# Altium schematic sheet schematic_v1.SchDoc
size A4
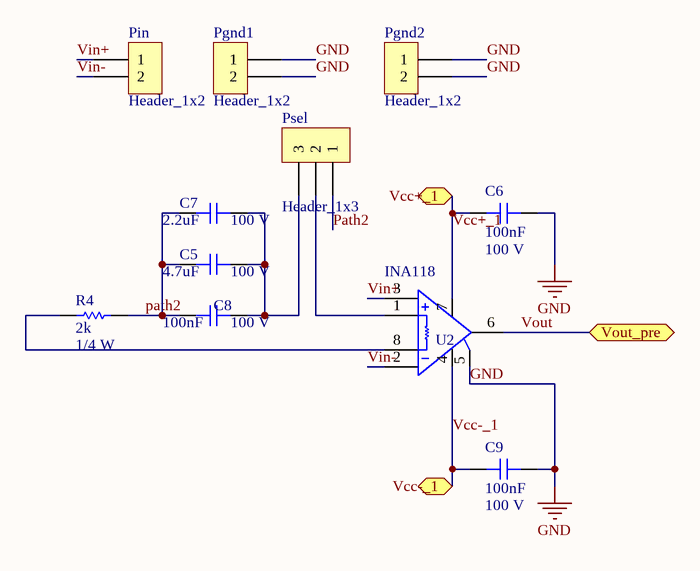
[diagram p0: schematic_v1.SchDoc]

## Parts
C5  4.7uF  Voltage: 100 V  [0805C]
C6  100nF  Voltage: 100 V  [0805C]
C7  2.2uF  Voltage: 100 V  [0805C]
C8  100nF  Voltage: 100 V  [0805C]
C9  100nF  Voltage: 100 V  [0805C]
Pgnd1  Header_1x2  [HDR-M-1x2-2.54mm-180-9.2mm]
Pgnd2  Header_1x2  [HDR-M-1x2-2.54mm-180-9.2mm]
Pin  Header_1x2  [HDR-M-1x2-2.54mm-180-9.2mm]
Psel  Header_1x3  [HDR-M-1x3-2.54mm-180-9.2mm]
R4  2k  Power: 1/4 W  [0805R]
U2  INA118  [SOIC08-150(50)]

## Ports
Vcc+_1, Vcc-_1, Vout_pre

## Nets
GND: C6.2 C9.2 Pgnd1.1 Pgnd1.2 Pgnd2.1 Pgnd2.2 U2.5(REF)
Path2: C5.1 C7.1 C8.1 Psel.1 R4.2
Vcc+_1: C6.1 U2.7(V+) ; port Vcc+_1
Vcc-_1: C9.1 U2.4(V-) ; port Vcc-_1
Vin+: Pin.1 U2.3(Vin+)
Vin-: Pin.2 U2.2(Vin-)
Vout: U2.6(OUT) ; port Vout_pre
NetC5_2: C5.2 C7.2 C8.2 Psel.3
NetPsel_2: Psel.2 U2.1(Rg+)
NetR4_1: R4.1 U2.8(Rg-)

## Library data of the parts
C5-C9 = Capacitor: Published: 8-Jun-2000; LatestRevisionDate: 17-Jul-2002; LatestRevisionNote: Re-released for DXP Platform.; PackageReference: RAD-0.3; Publisher: Altium Limited
Pgnd1 Pgnd2 Pin = Header_1x2: Header, 1 Line, 2 Columns, 2 Pins; LatestRevisionDate: 17-Jul-2002; LatestRevisionNote: Re-released for DXP Platform.; Publisher: Altium Limited
Psel = Header_1x3: Header, 1 Line, 3 Columns, 3 Pins; LatestRevisionDate: 17-Jul-2002; LatestRevisionNote: Re-released for DXP Platform.; Publisher: Altium Limited
R4 = Resistor: Tolerance: 5%; Published: 8-Jun-2000; LatestRevisionDate: 17-Jul-2002; LatestRevisionNote: Re-released for DXP Platform.; PackageReference: AXIAL-0.3; Publisher: Altium Limited
U2 = INA118: Precision, Low Power Instrumentation Amplifier